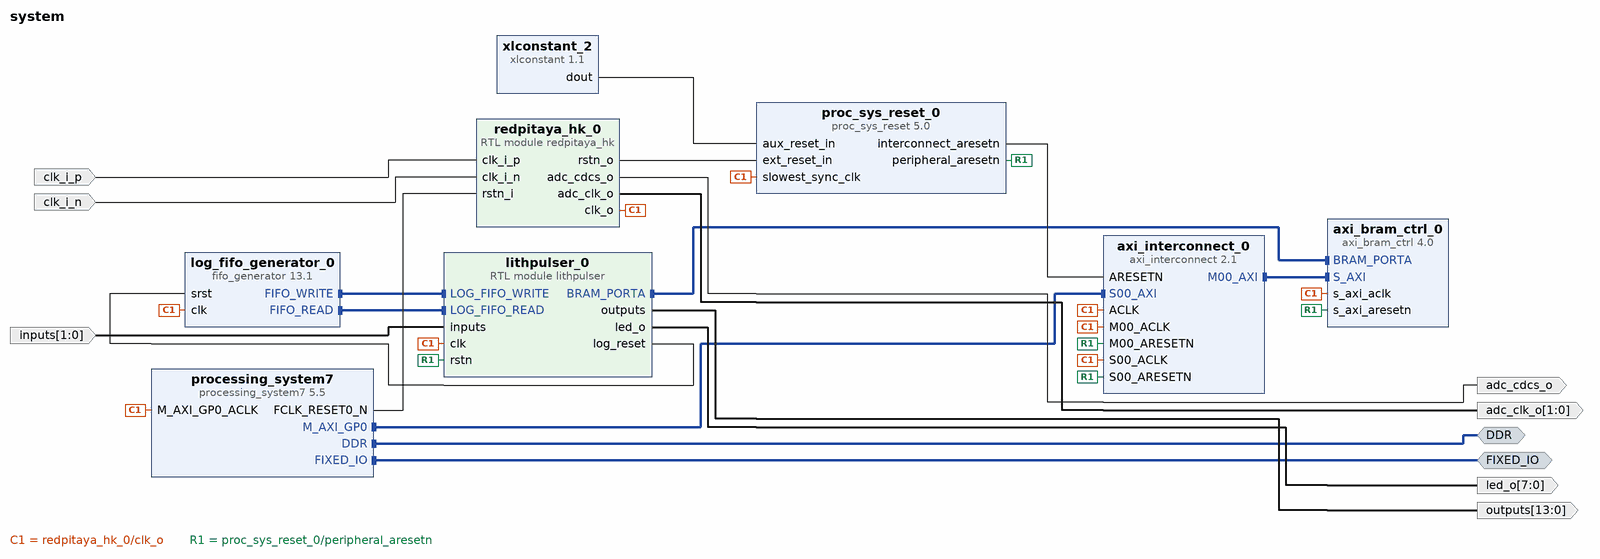
[diagram p0: block diagram of the top level]
# Vivado block design system, xc7z010clg400-1, Vivado 2016.4
create_bd_design system

create_bd_intf_port -mode Master -vlnv xilinx.com:interface:ddrx_rtl:1.0 DDR
create_bd_intf_port -mode Master -vlnv xilinx.com:display_processing_system7:fixedio_rtl:1.0 FIXED_IO
create_bd_port -dir I -from 1 -to 0 inputs
create_bd_port -dir O -from 13 -to 0 outputs
create_bd_port -dir O -from 7 -to 0 led_o
create_bd_port -dir I clk_i_p
create_bd_port -dir I clk_i_n
create_bd_port -dir O adc_cdcs_o
create_bd_port -dir O -from 1 -to 0 adc_clk_o

create_bd_cell -type ip -vlnv xilinx.com:ip:processing_system7:5.5 processing_system7
set_property -dict [list \
  CONFIG.PCW_QSPI_PERIPHERAL_FREQMHZ 125 \
  CONFIG.PCW_FPGA0_PERIPHERAL_FREQMHZ 125 \
  CONFIG.PCW_FPGA1_PERIPHERAL_FREQMHZ 250 \
  CONFIG.PCW_FPGA3_PERIPHERAL_FREQMHZ 200 \
  CONFIG.PCW_EN_CLK0_PORT 0 \
  CONFIG.PCW_PRESET_BANK1_VOLTAGE {LVCMOS 2.5V} \
  CONFIG.PCW_UIPARAM_DDR_BUS_WIDTH {16 Bit} \
  CONFIG.PCW_UIPARAM_DDR_PARTNO {MT41J256M16 RE-125} \
  CONFIG.PCW_QSPI_PERIPHERAL_ENABLE 1 \
  CONFIG.PCW_QSPI_GRP_SINGLE_SS_ENABLE 1 \
  CONFIG.PCW_ENET0_PERIPHERAL_ENABLE 1 \
  CONFIG.PCW_ENET0_ENET0_IO {MIO 16 .. 27} \
  CONFIG.PCW_ENET0_GRP_MDIO_ENABLE 1 \
  CONFIG.PCW_SD0_PERIPHERAL_ENABLE 1 \
  CONFIG.PCW_SD0_GRP_CD_ENABLE 1 \
  CONFIG.PCW_SD0_GRP_CD_IO {MIO 46} \
  CONFIG.PCW_SD0_GRP_WP_ENABLE 1 \
  CONFIG.PCW_SD0_GRP_WP_IO {MIO 47} \
  CONFIG.PCW_UART0_PERIPHERAL_ENABLE 1 \
  CONFIG.PCW_UART0_UART0_IO {MIO 14 .. 15} \
  CONFIG.PCW_UART1_PERIPHERAL_ENABLE 1 \
  CONFIG.PCW_UART1_UART1_IO {MIO 8 .. 9} \
  CONFIG.PCW_SPI1_PERIPHERAL_ENABLE 1 \
  CONFIG.PCW_SPI1_SPI1_IO {MIO 10 .. 15} \
  CONFIG.PCW_USB0_PERIPHERAL_ENABLE 0 \
  CONFIG.PCW_I2C0_PERIPHERAL_ENABLE 1 \
  CONFIG.PCW_I2C0_I2C0_IO {MIO 50 .. 51} \
  CONFIG.PCW_GPIO_MIO_GPIO_ENABLE 1 \
] [get_bd_cells processing_system7]
# 63 more settings of processing_system7 are not shown: defaults, MIO pin electricals, DDR timing, and values the tool derives
create_bd_cell -type ip -vlnv xilinx.com:ip:axi_interconnect:2.1 axi_interconnect_0
set_property -dict {CONFIG.NUM_MI 1} [get_bd_cells axi_interconnect_0]
create_bd_cell -type ip -vlnv xilinx.com:ip:proc_sys_reset:5.0 proc_sys_reset_0
create_bd_cell -type ip -vlnv xilinx.com:ip:axi_bram_ctrl:4.0 axi_bram_ctrl_0
set_property -dict {CONFIG.SINGLE_PORT_BRAM 1} [get_bd_cells axi_bram_ctrl_0]
create_bd_cell -type ip -vlnv xilinx.com:ip:fifo_generator:13.1 log_fifo_generator_0
set_property -dict [list \
  CONFIG.Input_Data_Width 57 \
  CONFIG.Input_Depth 16384 \
  CONFIG.Output_Data_Width 57 \
] [get_bd_cells log_fifo_generator_0]
create_bd_cell -type ip -vlnv xilinx.com:ip:xlconstant:1.1 xlconstant_2
set_property -dict {CONFIG.CONST_WIDTH 1 CONFIG.CONST_VAL 1} [get_bd_cells xlconstant_2]
create_bd_cell -type module -reference redpitaya_hk redpitaya_hk_0
create_bd_cell -type module -reference lithpulser lithpulser_0

# ---- connections ----

connect_bd_intf_net [get_bd_intf_pins processing_system7/M_AXI_GP0] [get_bd_intf_pins axi_interconnect_0/S00_AXI]
connect_bd_intf_net [get_bd_intf_pins axi_interconnect_0/M00_AXI] [get_bd_intf_pins axi_bram_ctrl_0/S_AXI]
connect_bd_intf_net -intf_net lithpulser_0_FIFO_WRITE [get_bd_intf_pins log_fifo_generator_0/FIFO_WRITE] [get_bd_intf_pins lithpulser_0/LOG_FIFO_WRITE]
connect_bd_intf_net -intf_net lithpulser_0_FIFO_READ [get_bd_intf_pins log_fifo_generator_0/FIFO_READ] [get_bd_intf_pins lithpulser_0/LOG_FIFO_READ]
connect_bd_intf_net [get_bd_intf_pins lithpulser_0/BRAM_PORTA] [get_bd_intf_pins axi_bram_ctrl_0/BRAM_PORTA]
connect_bd_intf_net -intf_net processing_system7_0_ddr [get_bd_intf_ports DDR] [get_bd_intf_pins processing_system7/DDR]
connect_bd_intf_net -intf_net processing_system7_0_fixed_io [get_bd_intf_ports FIXED_IO] [get_bd_intf_pins processing_system7/FIXED_IO]
connect_bd_net [get_bd_pins proc_sys_reset_0/interconnect_aresetn] [get_bd_pins axi_interconnect_0/ARESETN]
connect_bd_net [get_bd_pins lithpulser_0/log_reset] [get_bd_pins log_fifo_generator_0/srst]
connect_bd_net [get_bd_ports inputs] [get_bd_pins lithpulser_0/inputs]
connect_bd_net [get_bd_pins lithpulser_0/outputs] [get_bd_ports outputs]
connect_bd_net [get_bd_pins lithpulser_0/led_o] [get_bd_ports led_o]
connect_bd_net -net clk_wiz_0_clk_out1 [get_bd_pins redpitaya_hk_0/clk_o] \
  [get_bd_pins processing_system7/M_AXI_GP0_ACLK] [get_bd_pins proc_sys_reset_0/slowest_sync_clk] \
  [get_bd_pins axi_bram_ctrl_0/s_axi_aclk] [get_bd_pins log_fifo_generator_0/clk] [get_bd_pins lithpulser_0/clk] \
  [get_bd_pins axi_interconnect_0/ACLK] [get_bd_pins axi_interconnect_0/S00_ACLK] [get_bd_pins axi_interconnect_0/M00_ACLK]
connect_bd_net [get_bd_ports clk_i_p] [get_bd_pins redpitaya_hk_0/clk_i_p]
connect_bd_net [get_bd_ports clk_i_n] [get_bd_pins redpitaya_hk_0/clk_i_n]
connect_bd_net [get_bd_pins xlconstant_2/dout] [get_bd_pins proc_sys_reset_0/aux_reset_in]
connect_bd_net -net lithpulser_0_rstn_o [get_bd_pins redpitaya_hk_0/rstn_o] [get_bd_pins proc_sys_reset_0/ext_reset_in]
connect_bd_net [get_bd_pins proc_sys_reset_0/peripheral_aresetn] \
  [get_bd_pins axi_bram_ctrl_0/s_axi_aresetn] [get_bd_pins lithpulser_0/rstn] [get_bd_pins axi_interconnect_0/M00_ARESETN] \
  [get_bd_pins axi_interconnect_0/S00_ARESETN]
connect_bd_net [get_bd_pins processing_system7/FCLK_RESET0_N] [get_bd_pins redpitaya_hk_0/rstn_i]
connect_bd_net [get_bd_pins redpitaya_hk_0/adc_cdcs_o] [get_bd_ports adc_cdcs_o]
connect_bd_net [get_bd_pins redpitaya_hk_0/adc_clk_o] [get_bd_ports adc_clk_o]

# ---- address map ----
assign_bd_address -offset 0x40000000 -range 128K -target_address_space [get_bd_addr_spaces processing_system7/Data] [get_bd_addr_segs axi_bram_ctrl_0/S_AXI/Mem0]

validate_bd_design
save_bd_design
